# Altium schematic sheet 03-Batteries.SchDoc: Batteries
size A; Revision: A; SheetNumber: 2; SheetTotal: 11; ECE315_Project_Name: ECE453 F25 Power Mezzanine
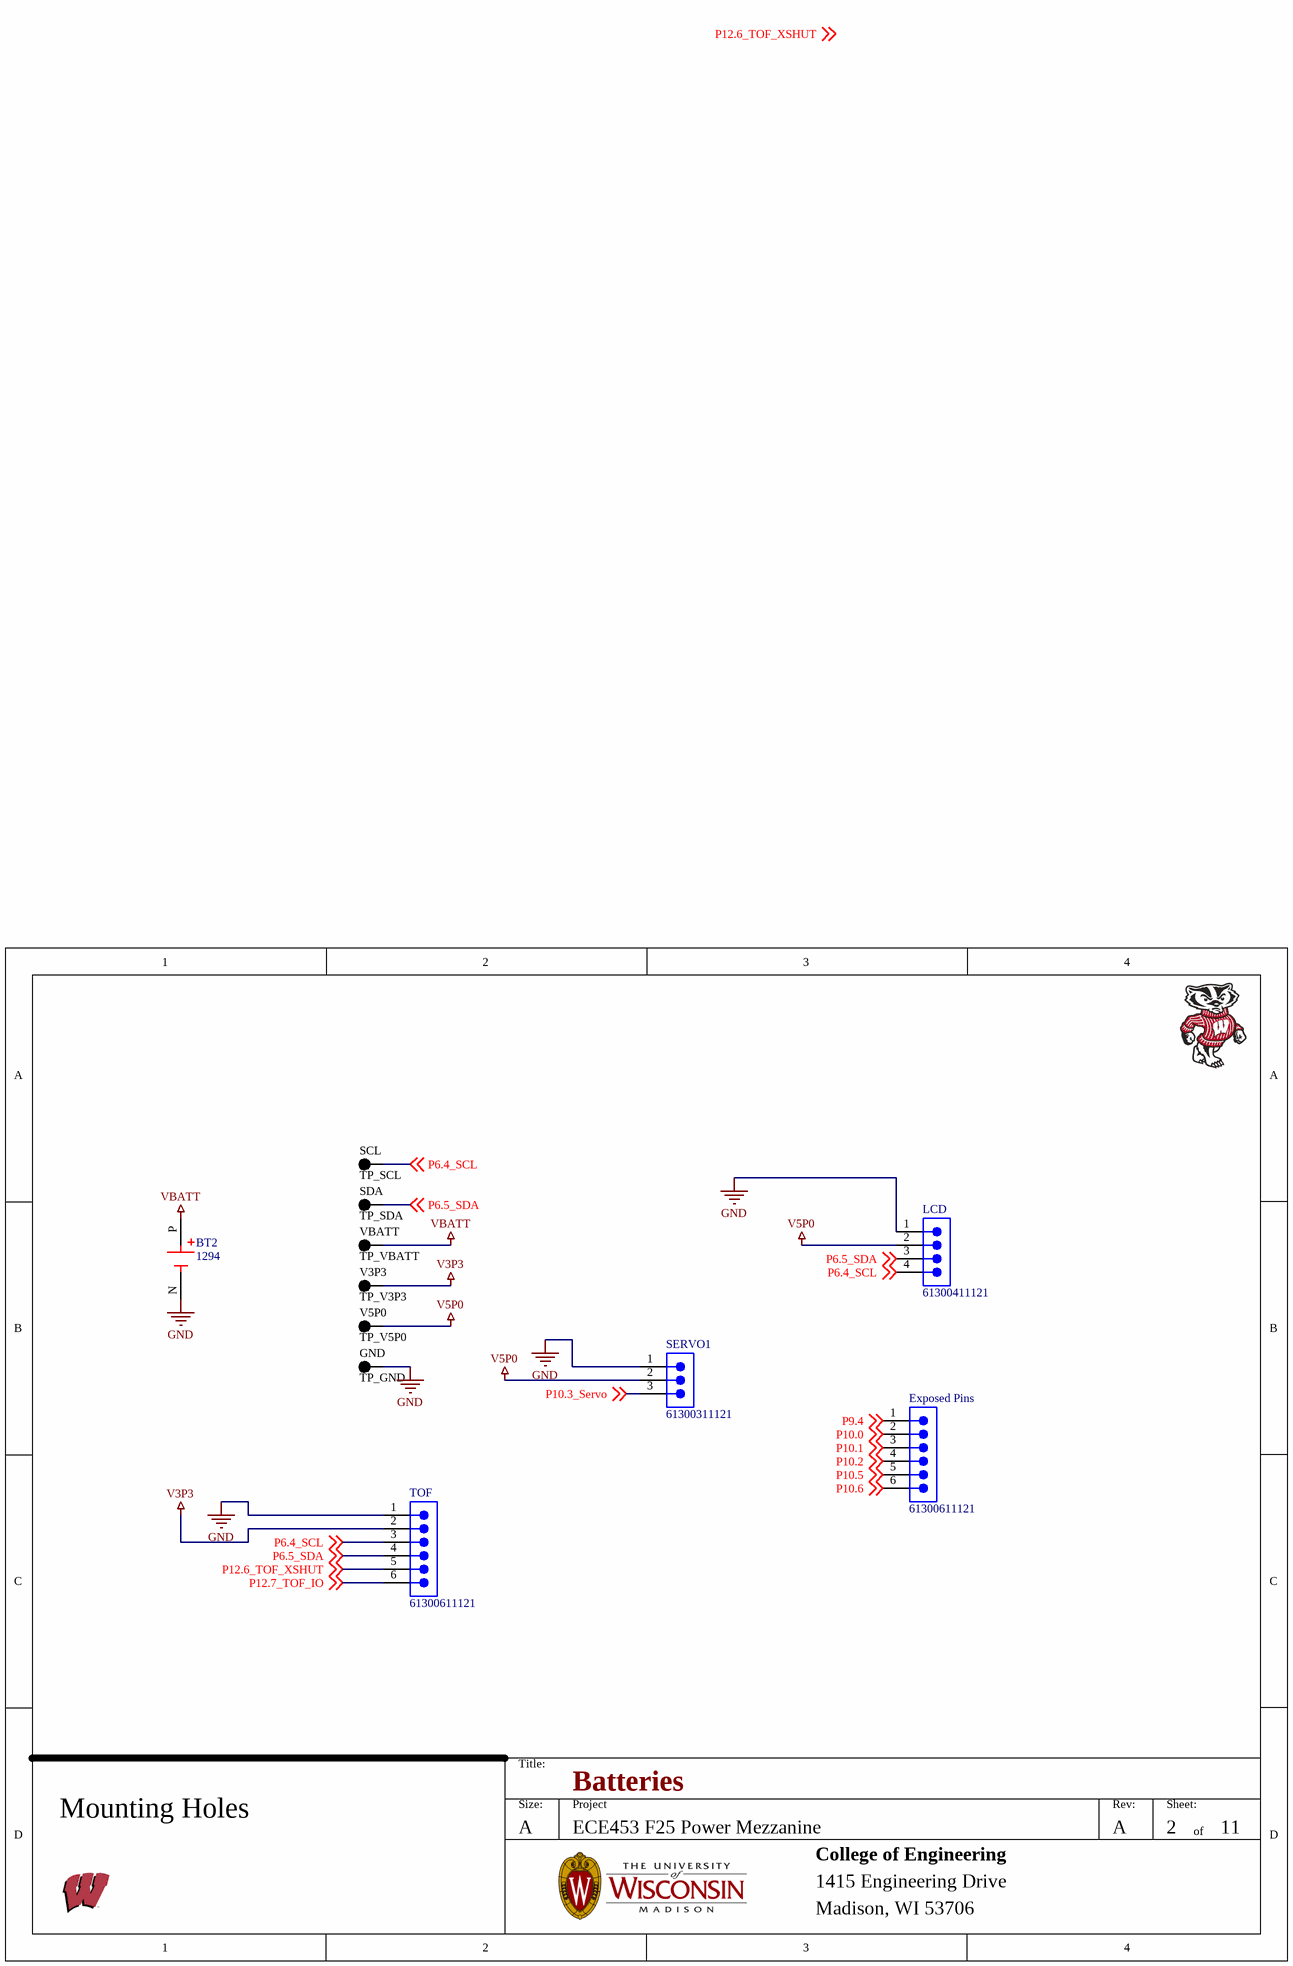
[diagram p0: 03-Batteries.SchDoc]

## Parts
BT2  1294  [BAT_1294]
Exposed_Pins  61300611121  [61300611121]
GND  TP_GND  [KSTN-5011_V]
LCD  61300411121  [61300411121]
SCL  TP_SCL  [KSTN-5011_V]
SDA  TP_SDA  [KSTN-5011_V]
SERVO1  61300311121  [61300311121]
TOF  61300611121  [61300611121]
V3P3  TP_V3P3  [KSTN-5011_V]
V5P0  TP_V5P0  [KSTN-5011_V]
VBATT  TP_VBATT  [KSTN-5011_V]

## Nets
GND: BT2.N(NEG) GND.1 LCD.1 SERVO1.1 TOF.1
V3P3: TOF.2 V3P3.1
V5P0: LCD.2 SERVO1.2 V5P0.1
VBATT: BT2.P(POS) VBATT.1
P6.4_SCL: LCD.4 SCL.1 TOF.3 ; off-sheet P6.4_SCL
P6.5_SDA: LCD.3 SDA.1 TOF.4 ; off-sheet P6.5_SDA
P9.4: Exposed_Pins.1 ; off-sheet P9.4
P10.0: Exposed_Pins.2 ; off-sheet P10.0
P10.1: Exposed_Pins.3 ; off-sheet P10.1
P10.2: Exposed_Pins.4 ; off-sheet P10.2
P10.3_Servo: SERVO1.3 ; off-sheet P10.3_Servo
P10.5: Exposed_Pins.5 ; off-sheet P10.5
P10.6: Exposed_Pins.6 ; off-sheet P10.6
P12.6_TOF_XSHUT: TOF.5 ; off-sheet P12.6_TOF_XSHUT
P12.7_TOF_IO: TOF.6 ; off-sheet P12.7_TOF_IO

## Notes on the sheet
- Mounting Holes
- Labels drawn without touching a wire or pin: P12.6_TOF_XSHUT
- Title:
- Size:
- A
- Project
- Rev:
- Sheet:
- of
- College of Engineering
- 1415 Engineering Drive
- Madison, WI 53706

## Library data of the parts
BT2 = 1294: Batteries/Accessories; MF: Keystone Electronics; Connector Type: PCB; Option: General Purpose; DIN Conformance: No; SnapEDA_Link: https://www.snapeda.com/parts/1294/Keystone/view-part/?ref=snap; Package: NON STANDARD-6 Keystone; Value: *; MP: 1294; Check_prices: https://www.snapeda.com/parts/1294/Keystone/view-part/?ref=eda; Supplier 1: Digikey; Supplier Part Number 1: 36-1294-ND; Manufacturer 1: Keystone Electronics; Manufacturer Part Number: 1294; RoHS: Yes; Category: Batteries and Accessories; Stock: 8657; Pricing: 1=2.89, 10=2.75, 500=2.13, 1000=1.65275, 2500=1.54001 (USD); Contact Finish - Mating: NOT SPECIFIED; IEC Conformance: No; MIL Conformance: No; Reach SVHC Compliant: Yes; RoHS Compliant: Yes; ComponentLink1URL: https://datasheet.ciiva.com:443/pdfs/VipMasterIC/IC/KEYC/KEYCS01036/KEYCS02682-1.pdf?src-supplier=IHS+Markit; ComponentLink1Description: https://datasheet.ciiva.com:443/pdfs/VipMasterIC/IC/KEYC/KEYCS01036/KEYCS02682-1.pdf?src-supplier=IHS+Markit; ComponentLink2URL: https://datasheet.ciiva.com/1391/1716650-1391274.pdf?src-supplier=Element14; ComponentLink2Description: https://datasheet.ciiva.com/1391/1716650-1391274.pdf?src-supplier=Element14; ComponentLink3URL: https://datasheet.ciiva.com/4/1294-4181.pdf?src-supplier=Digikey; ComponentLink3Description: https://datasheet.ciiva.com/4/1294-4181.pdf?src-supplier=Digikey; ComponentLink4URL: https://datasheet.ciiva.com/18403/70182887-18403178.pdf?src-supplier=Allied+Electronics; ComponentLink4Description: https://datasheet.ciiva.com/18403/70182887-18403178.pdf?src-supplier=Allied+Electronics
Exposed_Pins TOF = CMP-1502-01070-3: NexarPartId: 20084590; Current Rating: 3A; Pitch: 2.54mm; Gender: Male; Operating Supply Voltage: 250V; Connector Type: Male Pin; Number of Positions: 6; Contact Resistance: 20mΩ; Packaging: Bulk; Number of Pins: 6; Number of Rows: 1; Contact Plating: Gold; Lead Free: Lead Free; RoHS: Compliant; Contact Mating Length: 5.9944mm; Voltage Rating: 250V; REACH SVHC: Unknown; Contact Gender: Male; Housing Material: PBT; Min Operating Temperature: -40°C; Lead Pitch: 2.54mm; Mount: Through Hole; Number of Contacts: 6; Max Operating Temperature: 105°C; Contact Material: Copper; Orientation: Vertical; Termination: Through Hole; Color: Black; Height: 8.89mm
GND SCL SDA V3P3 V5P0 VBATT = CMP-1672-00003-4: Test Point, Black, Through Hole, RoHS, Bulk; Manufacturer: Keystone; ComponentLink2URL: http://www.keyelco.com/product-pdf.cfm?p=1320; Colour: Black; Pins: 1; REACH SVHC: No SVHC; ComponentLink1URL: http://www.keyelco.com/; PackageReference: 5011; Contact Plating: Silver; Package Quantity: 100; Packaging: Bulk; RoHSCompliant: true; Height: 8.12 mm; PackageDescription: 1-Pin Through Hole Device, Dia 3.17 mm; Mount: Through Hole; Mounting Technology: Through Hole; DatasheetVersion: Rev. F, 12/2013; ComponentLink1Description: Manufacturer URL; Contact Material: Bronze; ComponentLink2Description: Datasheet
LCD = CMP-1502-01064-3: NexarPartId: 32855522; Operating Supply Voltage: 250V; Pitch: 2.54mm; Contact Resistance: 20mΩ; Number of Positions: 4; Current Rating: 3A; Connector Type: Male Pin; Gender: Male; Contact Plating: Gold; Height: 8.89mm; Lead Pitch: 2.54mm; Lead Free: Lead Free; Contact Mating Length: 5.9944mm; Number of Rows: 1; Termination: Solder; Packaging: Bulk; REACH SVHC: Unknown; Min Operating Temperature: -40°C; RoHS: Compliant; Number of Contacts: 4; Voltage Rating: 250V; Color: Black; Max Operating Temperature: 105°C; Contact Material: Copper; Mount: Through Hole; Orientation: Vertical; Number of Pins: 4
SERVO1 = CMP-1502-01062-3: NexarPartId: 32855521; Current Rating: 3A; Voltage Rating: 250V; Number of Positions: 3; Pitch: 2.54mm; Contact Resistance: 20mΩ; Connector Type: Male Pin; Gender: Male; REACH SVHC: Unknown; Packaging: Bulk; Contact Material: Copper; Min Operating Temperature: -40°C; Number of Rows: 1; Orientation: Vertical; RoHS: Compliant; Contact Plating: Gold; Max Operating Temperature: 105°C; Mount: Through Hole; Height: 8.94mm; Operating Supply Voltage: 250V; Number of Pins: 3; Contact Mating Length: 5.9944mm; Number of Contacts: 3; Color: Black; Lead Free: Lead Free; Lead Pitch: 2.54mm; Termination: Solder